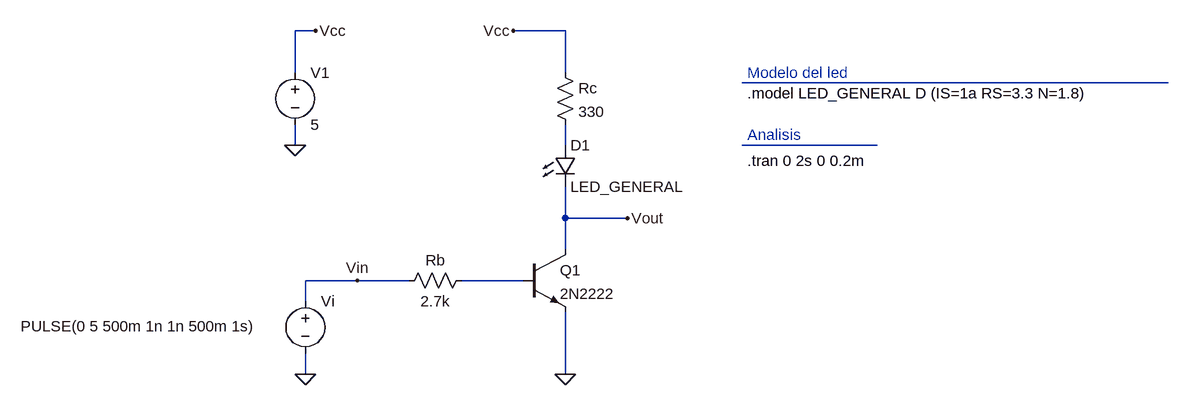
[diagram p0: schematic bjt_relay-driver.asc]
bjt_relay-driver.asc, the LTspice schematic file:
Version 4
SHEET 1 1052 680
WIRE -304 -240 -336 -240
WIRE 80 -240 0 -240
WIRE -336 -176 -336 -240
WIRE 80 -176 80 -240
WIRE 1008 -160 352 -160
WIRE -336 -64 -336 -96
WIRE 80 -64 80 -96
WIRE 560 -64 352 -64
WIRE 80 48 80 0
WIRE 176 48 80 48
WIRE 80 96 80 48
WIRE -240 144 -320 144
WIRE -160 144 -240 144
WIRE 16 144 -80 144
WIRE -320 176 -320 144
WIRE -320 288 -320 256
WIRE 80 288 80 192
FLAG 80 288 0
FLAG -336 -64 0
FLAG -304 -240 Vcc
FLAG -320 288 0
FLAG 0 -240 Vcc
FLAG -240 144 Vin
FLAG 176 48 Vout
SYMBOL npn 16 96 R0
SYMATTR InstName Q1
SYMATTR Value 2N2222
SYMBOL res -176 160 R270
WINDOW 0 32 56 VTop 2
WINDOW 3 0 56 VBottom 2
SYMATTR InstName Rb
SYMATTR Value 2.7k
SYMBOL res 64 -192 R0
SYMATTR InstName Rc
SYMATTR Value 330
SYMBOL voltage -336 -192 R0
WINDOW 123 0 0 Left 0
WINDOW 39 0 0 Left 0
SYMATTR InstName V1
SYMATTR Value 5
SYMBOL voltage -320 160 R0
WINDOW 3 -438 54 Left 2
WINDOW 123 0 0 Left 0
WINDOW 39 0 0 Left 0
SYMATTR Value PULSE(0 5 500m 1n 1n 500m 1s)
SYMATTR InstName Vi
SYMBOL LED 64 -64 R0
SYMATTR InstName D1
SYMATTR Value LED_GENERAL
TEXT 360 -40 Left 2 !.tran 0 2s 0 0.2m
TEXT 360 -80 Left 2 ;Analisis
TEXT 360 -144 Left 2 !.model LED_GENERAL D (IS=1a RS=3.3 N=1.8)
TEXT 360 -176 Left 2 ;Modelo del led

The netlist it stands for:
* bjt_relay-driver.asc
Q1 Vout N004 0 0 2N2222
Rb Vin N004 2.7k
Rc Vcc N002 330
V1 Vcc 0 5
Vi Vin 0 PULSE(0 5 500m 1n 1n 500m 1s)
D1 N002 Vout LED_GENERAL
.model D D
.lib standard.dio
.model NPN NPN
.model PNP PNP
.lib standard.bjt
.tran 0 2s 0 0.2m
* Analisis
.model LED_GENERAL D (IS=1a RS=3.3 N=1.8)
* Modelo del led
.backanno
.end